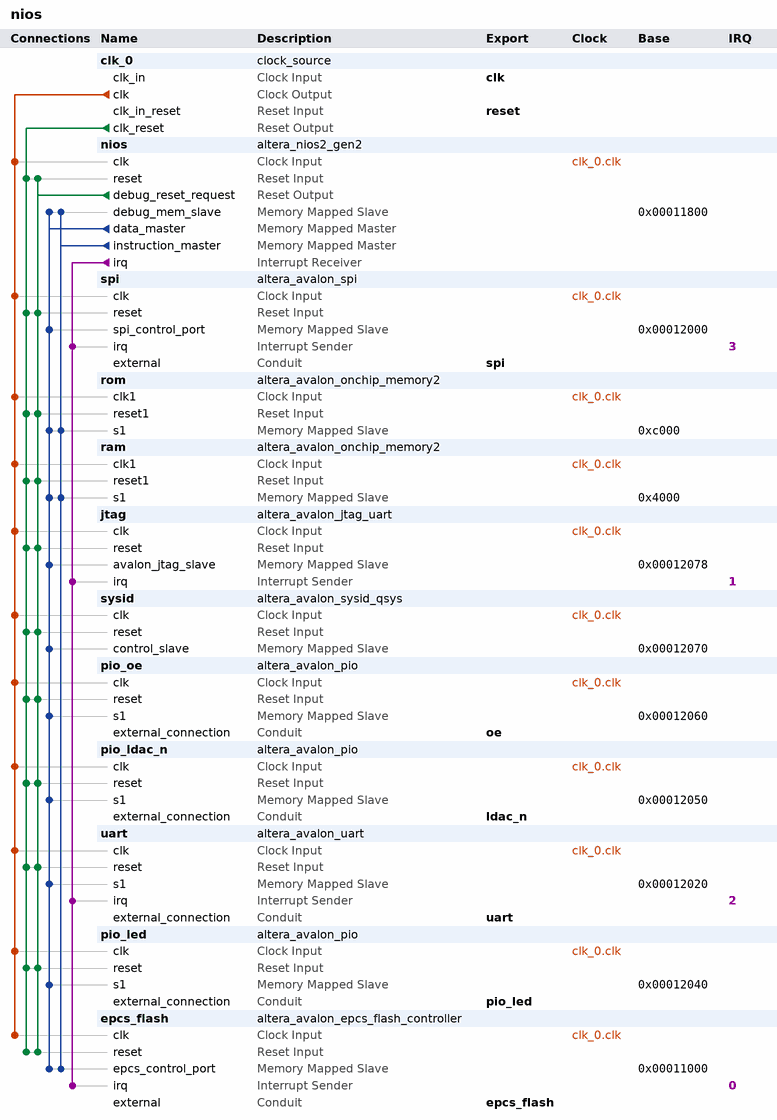
[diagram p0: system contents]
# Platform Designer (Qsys) system nios, Cyclone IV E EP4CE10F17C8
# Parameters at their usual value, and those the tool derives, are not listed.
package require -exact qsys 18.1
create_system nios
set_project_property DEVICE_FAMILY {Cyclone IV E}
set_project_property DEVICE EP4CE10F17C8

add_instance clk_0 clock_source 18.1
set_instance_parameter_value clk_0 clockFrequency 100000000

add_instance nios altera_nios2_gen2 18.1
set_instance_parameter_value nios dcache_size 2048
set_instance_parameter_value nios exceptionSlave ram.s1
set_instance_parameter_value nios icache_size 4096
set_instance_parameter_value nios impl Fast
set_instance_parameter_value nios resetSlave epcs_flash.epcs_control_port

add_instance spi altera_avalon_spi 18.1
set_instance_parameter_value spi clockPolarity 0
set_instance_parameter_value spi dataWidth 8
set_instance_parameter_value spi masterSPI true
set_instance_parameter_value spi numberOfSlaves 1
set_instance_parameter_value spi targetClockRate 16000000

add_instance rom altera_avalon_onchip_memory2 18.1
set_instance_parameter_value rom dataWidth 32
set_instance_parameter_value rom dualPort false
set_instance_parameter_value rom initMemContent true
set_instance_parameter_value rom initializationFileName onchip_mem.hex
set_instance_parameter_value rom memorySize 10240
set_instance_parameter_value rom writable false

add_instance ram altera_avalon_onchip_memory2 18.1
set_instance_parameter_value ram dataWidth 32
set_instance_parameter_value ram dualPort false
set_instance_parameter_value ram initMemContent true
set_instance_parameter_value ram initializationFileName onchip_mem.hex
set_instance_parameter_value ram memorySize 16384

add_instance jtag altera_avalon_jtag_uart 18.1
set_instance_parameter_value jtag simInteractiveOptions NO_INTERACTIVE_WINDOWS

add_instance sysid altera_avalon_sysid_qsys 18.1
set_instance_parameter_value sysid id 0

add_instance pio_oe altera_avalon_pio 18.1
set_instance_parameter_value pio_oe direction Output
set_instance_parameter_value pio_oe resetValue 4294967295
set_instance_parameter_value pio_oe width 32

add_instance pio_ldac_n altera_avalon_pio 18.1
set_instance_parameter_value pio_ldac_n direction Output
set_instance_parameter_value pio_ldac_n width 1

add_instance uart altera_avalon_uart 18.1
set_instance_parameter_value uart baud 115200
set_instance_parameter_value uart dataBits 8
set_instance_parameter_value uart fixedBaud false
set_instance_parameter_value uart parity NONE
set_instance_parameter_value uart stopBits 1

add_instance pio_led altera_avalon_pio 18.1
set_instance_parameter_value pio_led direction Output
set_instance_parameter_value pio_led width 1

add_instance epcs_flash altera_avalon_epcs_flash_controller 18.1
set_instance_parameter_value epcs_flash resetrequest_enabled true

# connections
add_connection clk_0.clk epcs_flash.clk clock
add_connection clk_0.clk jtag.clk clock
add_connection clk_0.clk nios.clk clock
add_connection clk_0.clk pio_ldac_n.clk clock
add_connection clk_0.clk pio_led.clk clock
add_connection clk_0.clk pio_oe.clk clock
add_connection clk_0.clk ram.clk1 clock
add_connection clk_0.clk rom.clk1 clock
add_connection clk_0.clk spi.clk clock
add_connection clk_0.clk sysid.clk clock
add_connection clk_0.clk uart.clk clock
add_connection clk_0.clk_reset epcs_flash.reset reset
add_connection clk_0.clk_reset jtag.reset reset
add_connection clk_0.clk_reset nios.reset reset
add_connection clk_0.clk_reset pio_ldac_n.reset reset
add_connection clk_0.clk_reset pio_led.reset reset
add_connection clk_0.clk_reset pio_oe.reset reset
add_connection clk_0.clk_reset ram.reset1 reset
add_connection clk_0.clk_reset rom.reset1 reset
add_connection clk_0.clk_reset spi.reset reset
add_connection clk_0.clk_reset sysid.reset reset
add_connection clk_0.clk_reset uart.reset reset
add_connection nios.debug_reset_request epcs_flash.reset reset
add_connection nios.debug_reset_request jtag.reset reset
add_connection nios.debug_reset_request nios.reset reset
add_connection nios.debug_reset_request pio_ldac_n.reset reset
add_connection nios.debug_reset_request pio_led.reset reset
add_connection nios.debug_reset_request pio_oe.reset reset
add_connection nios.debug_reset_request ram.reset1 reset
add_connection nios.debug_reset_request rom.reset1 reset
add_connection nios.debug_reset_request spi.reset reset
add_connection nios.debug_reset_request sysid.reset reset
add_connection nios.debug_reset_request uart.reset reset
add_connection nios.data_master epcs_flash.epcs_control_port avalon
set_connection_parameter_value nios.data_master/epcs_flash.epcs_control_port baseAddress 0x00011000
add_connection nios.data_master jtag.avalon_jtag_slave avalon
set_connection_parameter_value nios.data_master/jtag.avalon_jtag_slave baseAddress 0x00012078
add_connection nios.data_master nios.debug_mem_slave avalon
set_connection_parameter_value nios.data_master/nios.debug_mem_slave baseAddress 0x00011800
add_connection nios.data_master pio_ldac_n.s1 avalon
set_connection_parameter_value nios.data_master/pio_ldac_n.s1 baseAddress 0x00012050
add_connection nios.data_master pio_led.s1 avalon
set_connection_parameter_value nios.data_master/pio_led.s1 baseAddress 0x00012040
add_connection nios.data_master pio_oe.s1 avalon
set_connection_parameter_value nios.data_master/pio_oe.s1 baseAddress 0x00012060
add_connection nios.data_master ram.s1 avalon
set_connection_parameter_value nios.data_master/ram.s1 baseAddress 0x4000
add_connection nios.data_master rom.s1 avalon
set_connection_parameter_value nios.data_master/rom.s1 baseAddress 0xc000
add_connection nios.data_master spi.spi_control_port avalon
set_connection_parameter_value nios.data_master/spi.spi_control_port baseAddress 0x00012000
add_connection nios.data_master sysid.control_slave avalon
set_connection_parameter_value nios.data_master/sysid.control_slave baseAddress 0x00012070
add_connection nios.data_master uart.s1 avalon
set_connection_parameter_value nios.data_master/uart.s1 baseAddress 0x00012020
add_connection nios.instruction_master epcs_flash.epcs_control_port avalon
set_connection_parameter_value nios.instruction_master/epcs_flash.epcs_control_port baseAddress 0x00011000
add_connection nios.instruction_master nios.debug_mem_slave avalon
set_connection_parameter_value nios.instruction_master/nios.debug_mem_slave baseAddress 0x00011800
add_connection nios.instruction_master ram.s1 avalon
set_connection_parameter_value nios.instruction_master/ram.s1 baseAddress 0x4000
add_connection nios.instruction_master rom.s1 avalon
set_connection_parameter_value nios.instruction_master/rom.s1 baseAddress 0xc000
add_connection nios.irq epcs_flash.irq interrupt
set_connection_parameter_value nios.irq/epcs_flash.irq irqNumber 0
add_connection nios.irq jtag.irq interrupt
set_connection_parameter_value nios.irq/jtag.irq irqNumber 1
add_connection nios.irq spi.irq interrupt
set_connection_parameter_value nios.irq/spi.irq irqNumber 3
add_connection nios.irq uart.irq interrupt
set_connection_parameter_value nios.irq/uart.irq irqNumber 2

# exported interfaces
add_interface clk clock sink
set_interface_property clk EXPORT_OF clk_0.clk_in
add_interface epcs_flash conduit end
set_interface_property epcs_flash EXPORT_OF epcs_flash.external
add_interface ldac_n conduit end
set_interface_property ldac_n EXPORT_OF pio_ldac_n.external_connection
add_interface oe conduit end
set_interface_property oe EXPORT_OF pio_oe.external_connection
add_interface pio_led conduit end
set_interface_property pio_led EXPORT_OF pio_led.external_connection
add_interface reset reset sink
set_interface_property reset EXPORT_OF clk_0.clk_in_reset
add_interface spi conduit end
set_interface_property spi EXPORT_OF spi.external
add_interface uart conduit end
set_interface_property uart EXPORT_OF uart.external_connection

set_interconnect_requirement {$system} qsys_mm.clockCrossingAdapter HANDSHAKE
set_interconnect_requirement {$system} qsys_mm.enableEccProtection FALSE
set_interconnect_requirement {$system} qsys_mm.insertDefaultSlave FALSE
set_interconnect_requirement {$system} qsys_mm.maxAdditionalLatency 1

save_system nios.qsys
